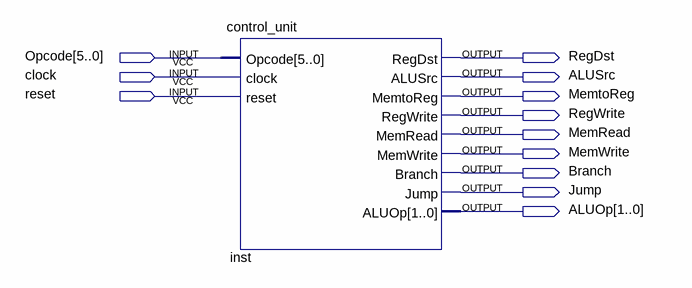
[diagram p0: schematic sheet]
// Quartus schematic control_unit_block.bdf as structural Verilog: 1 symbols, 12 pins
module control_unit_block (
  input  [5:0] Opcode,
  input  clock,
  input  reset,
  output RegDst,
  output ALUSrc,
  output MemtoReg,
  output RegWrite,
  output MemRead,
  output MemWrite,
  output Branch,
  output Jump,
  output [1:0] ALUOp
);

  control_unit inst (
    .Opcode(Opcode), .clock(clock), .reset(reset), .RegDst(RegDst), .ALUSrc(ALUSrc), .MemtoReg(MemtoReg),
    .RegWrite(RegWrite), .MemRead(MemRead), .MemWrite(MemWrite), .Branch(Branch), .Jump(Jump), .ALUOp(ALUOp));
endmodule
